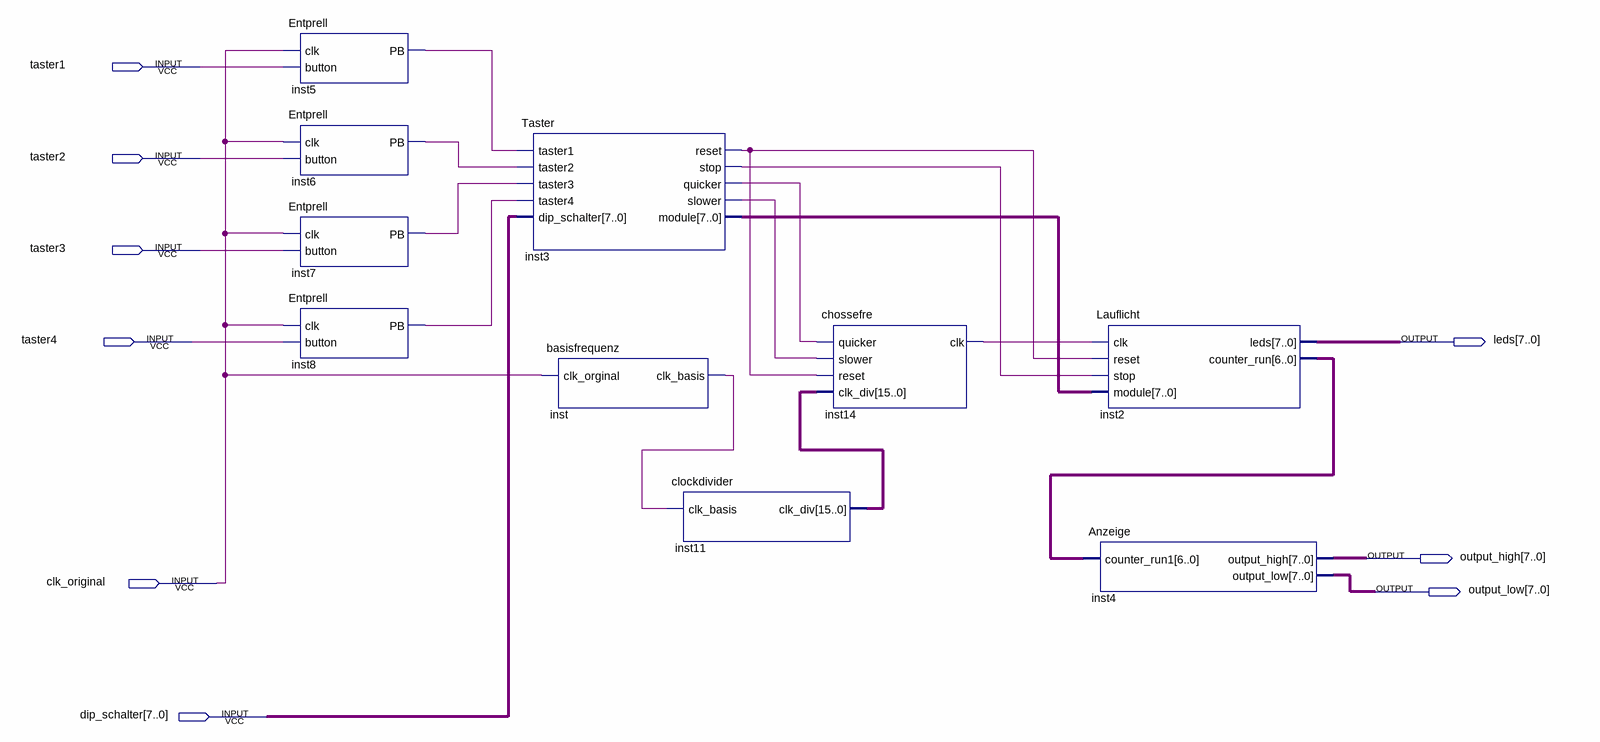
[diagram p0: schematic sheet]
// Quartus schematic system_gesamt.bdf as structural Verilog: 10 symbols, 9 pins
module system_gesamt (
  input  taster1,
  input  taster2,
  input  taster3,
  input  taster4,
  input  clk_original,
  input  [7:0] dip_schalter,
  output [7:0] leds,
  output [7:0] output_high,
  output [7:0] output_low
);

  wire inst3_quicker, inst3_reset, inst3_slower, inst3_stop, inst5_pb, inst6_pb, inst7_pb, inst8_pb,
       inst14_clk, inst_clk_basis;
  wire [6:0] inst2_counter_run;
  wire [7:0] inst3_module;
  wire [15:0] inst11_clk_div;

  Entprell inst5 (.clk(clk_original), .button(taster1), .PB(inst5_pb));
  Entprell inst6 (.clk(clk_original), .button(taster2), .PB(inst6_pb));
  Entprell inst7 (.clk(clk_original), .button(taster3), .PB(inst7_pb));
  Entprell inst8 (.clk(clk_original), .button(taster4), .PB(inst8_pb));
  Taster inst3 (
    .taster1(inst5_pb), .taster2(inst6_pb), .taster3(inst7_pb), .taster4(inst8_pb),
    .dip_schalter(dip_schalter), .reset(inst3_reset), .stop(inst3_stop), .quicker(inst3_quicker),
    .slower(inst3_slower), .\module (inst3_module));
  basisfrequenz inst (.clk_orginal(clk_original), .clk_basis(inst_clk_basis));
  clockdivider inst11 (.clk_basis(inst_clk_basis), .clk_div(inst11_clk_div));
  chossefre inst14 (
    .quicker(inst3_quicker), .slower(inst3_slower), .reset(inst3_reset), .clk_div(inst11_clk_div),
    .clk(inst14_clk));
  Lauflicht inst2 (
    .clk(inst14_clk), .reset(inst3_reset), .stop(inst3_stop), .\module (inst3_module), .leds(leds),
    .counter_run(inst2_counter_run));
  Anzeige inst4 (.counter_run1(inst2_counter_run), .output_high(output_high), .output_low(output_low));
endmodule
